# EAGLE design breakout_tester_1_0 (EAGLE 6.6.0)
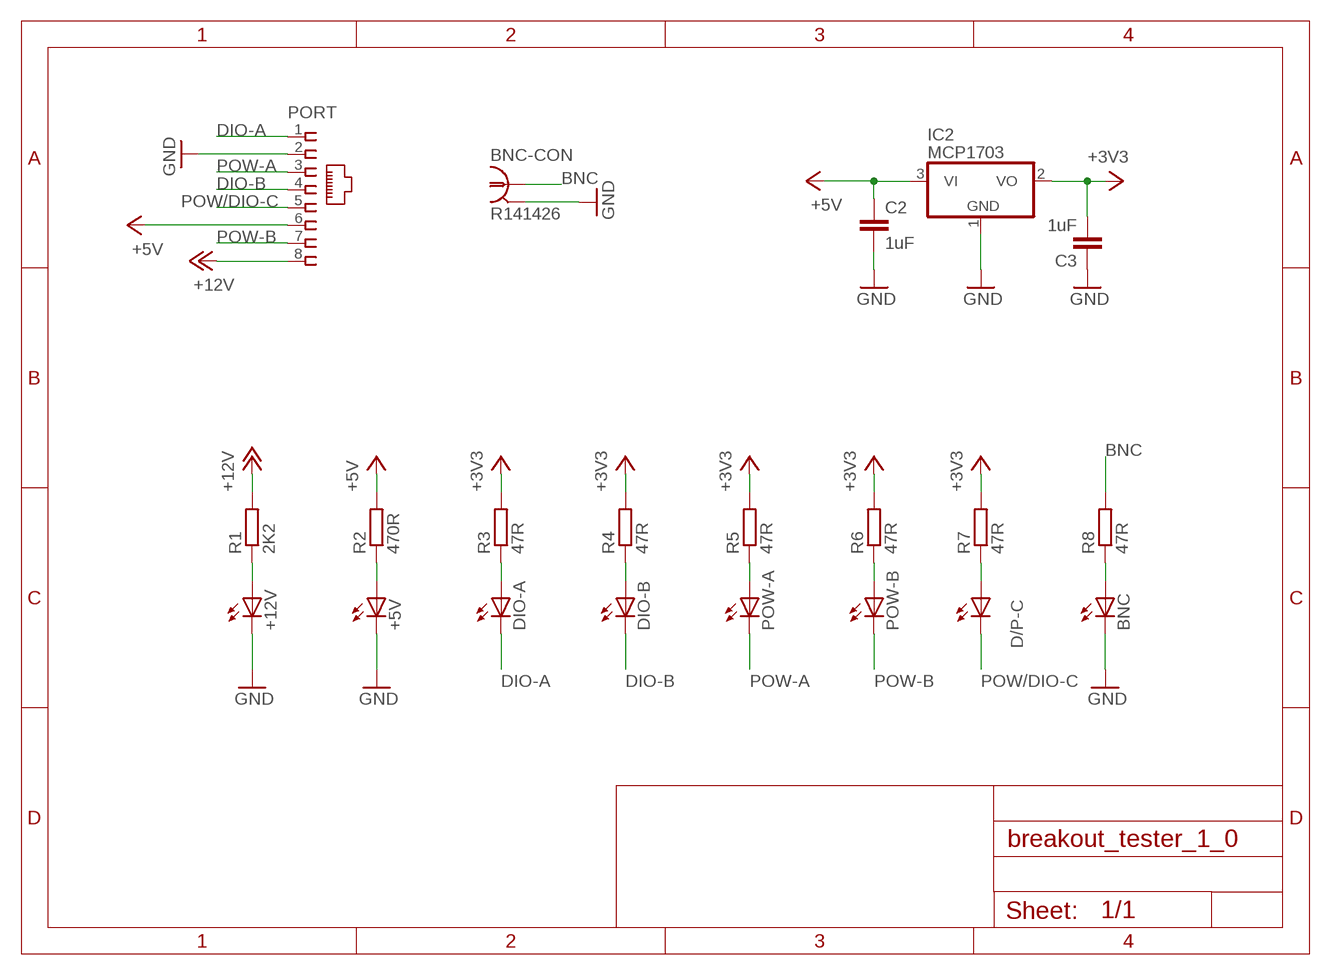
[diagram p0: schematic, sheet 1]

## Parts
+5V  LEDSML0805  [SML0805]
+12V  LEDSML0805  [SML0805]
BNC  LEDSML0805  [SML0805]
BNC-CON  R141426  [R141426]
C2  1uF  C-EUC0805  [C0805]
C3  1uF  C-EUC0805  [C0805]
D/P-C  LEDSML0805  [SML0805]
DIO-A  LEDSML0805  [SML0805]
DIO-B  LEDSML0805  [SML0805]
IC2  MCP1703  MCP1703CB  [SOT23]
PORT  RJ45VERTICAL  [RJ45-NO-SHIELD-VERTICAL]
POW-A  LEDSML0805  [SML0805]
POW-B  LEDSML0805  [SML0805]
R1  2K2  R-EU_M0805  [M0805]
R2  470R  R-EU_M0805  [M0805]
R3  47R  R-EU_M0805  [M0805]
R4  47R  R-EU_M0805  [M0805]
R5  47R  R-EU_M0805  [M0805]
R6  47R  R-EU_M0805  [M0805]
R7  47R  R-EU_M0805  [M0805]
R8  47R  R-EU_M0805  [M0805]

## Nets
+3V3: C3.2 IC2.2(VO) R3.2 R4.2 R5.2 R6.2 R7.2
+5V: C2.1 IC2.3(VI) PORT.6 R2.2
+12V: PORT.8 R1.2
BNC: BNC-CON.1 R8.2
DIO-A: DIO-A.C PORT.1
DIO-B: DIO-B.C PORT.4
GND: +5V.C +12V.C BNC-CON.2(GND) BNC.C C2.2 C3.1 IC2.1(GND) PORT.2
N$1: DIO-B.A R4.1
N$2: POW-A.A R5.1
N$3: POW-B.A R6.1
N$4: D/P-C.A R7.1
N$5: BNC.A R8.1
N$6: +12V.A R1.1
N$7: +5V.A R2.1
N$10: DIO-A.A R3.1
POW-A: PORT.3 POW-A.C
POW-B: PORT.7 POW-B.C
POW/DIO-C: D/P-C.C PORT.5

## Power pins joined to a net without a drawn wire
GND: BNC-CON.3(GND) BNC-CON.4(GND) BNC-CON.5(GND)

## Library data of the parts
+5V +12V BNC D/P-C DIO-A DIO-B POW-A POW-B = led:LED: LED OSRAM: - CHIPLED LG R971, LG N971, LY N971, LG Q971, LY Q971, LO R971, LY R971 LH N974, LH R974 LS Q976, LO Q976, LY Q976 LO Q996 - Hyper CHIPLED LW Q18S LB Q993, LB Q99A, LB R99A - SideLED LS A670, LO A670, LY A670, LG A670, LP A670 LB A673, LV A673, LT A673, LW A673 LH A674 LY A675 LS A676, LA A676, LO A676, LY A676, LW A676 LS A679, LY A679, LG A679 - Hyper Micro SIDELED® LS Y876, LA Y876, LO Y876, LY Y876 LT Y87S - SmartLED LW L88C, LW L88S LB L89C, LB L89S, LG L890 LS L89K, LO L89K, LY L89K LS L896, LA L896, LO L896, LY L896 - TOPLED LS T670, LO T670, LY T670, LG T670, LP T670 LSG T670, LSP T670, LSY T670, LOP T670, LYG T670 LG T671, LOG T671, LSG T671 LB T673, LV T673, LT T673, LW T673 LH T674 LS T676, LA T676, LO T676, LY T676, LB T676, LH T676, LSB T676, LW T676 LB T67C, LV T67C, LT T67C, LS T67K, LO T67K, LY T67K, LW E67C LS E67B, LA E67B, LO E67B, LY E67B, LB E67C, LV E67C, LT E67C LW T67C LS T679, LY T679, LG T679 LS T770, LO T770, LY T770, LG T770, LP T770 LB T773, LV T773, LT T773, LW T773 LH T774 LS E675, LA E675, LY E675, LS T675 LS T776, LA T776, LO T776, LY T776, LB T776 LHGB T686 LT T68C, LB T68C - Hyper Mini TOPLED® LB M676 - Mini TOPLED Santana® LG M470 LS M47K, LO M47K, LY M47K Source: http://www.osram.convergy.de LUXEON: - LUMILED® LXK2-PW12-R00, LXK2-PW12-S00, LXK2-PW14-U00, LXK2-PW14-V00 LXK2-PM12-R00, LXK2-PM12-S00, LXK2-PM14-U00 LXK2-PE12-Q00, LXK2-PE12-R00, LXK2-PE12-S00, LXK2-PE14-T00, LXK2-PE14-U00 LXK2-PB12-K00, LXK2-PB12-L00, LXK2-PB12-M00, LXK2-PB14-N00, LXK2-PB14-P00, LXK2-PB14-Q00 LXK2-PR12-L00, LXK2-PR12-M00, LXK2-PR14-Q00, LXK2-PR14-R00 LXK2-PD12-Q00, LXK2-PD12-R00, LXK2-PD12-S00 LXK2-PH12-R00, LXK2-PH12-S00 LXK2-PL12-P00, LXK2-PL12-Q00, LXK2-PL12-R00 Source: www.luxeon.com KINGBRIGHT: KA-3528ASYC Source: www.kingbright.com
BNC-CON = con-coax:R141426: BNC COAX CONNECTOR Radiall 50/75 Ohm Spoerle; MF: FARNELL; MPN: R141426161; OC_FARNELL: 4195115; OC_NEWARK: 14J7919
C2 = resistor:C-EU: CAPACITOR, European symbol
C3 = rcl:C-EU: CAPACITOR, European symbol
IC2 = linear:MCP1703: 250 mA, 16V, Low Quiescent Current LDO Regulator Source: http://ww1.microchip.com/downloads/en/DeviceDoc/22049b.pdf
PORT = con-tycoelectronics-vertical_RJ45:RJ45: CORCOM Modular RJ Jacks No Shield Source: www.tycoelectronics.com .. ENG_DS_1654001_1099_RJ_L_0507.pdf
R1-R8 = resistor:R-EU_: RESISTOR, European symbol

## Board
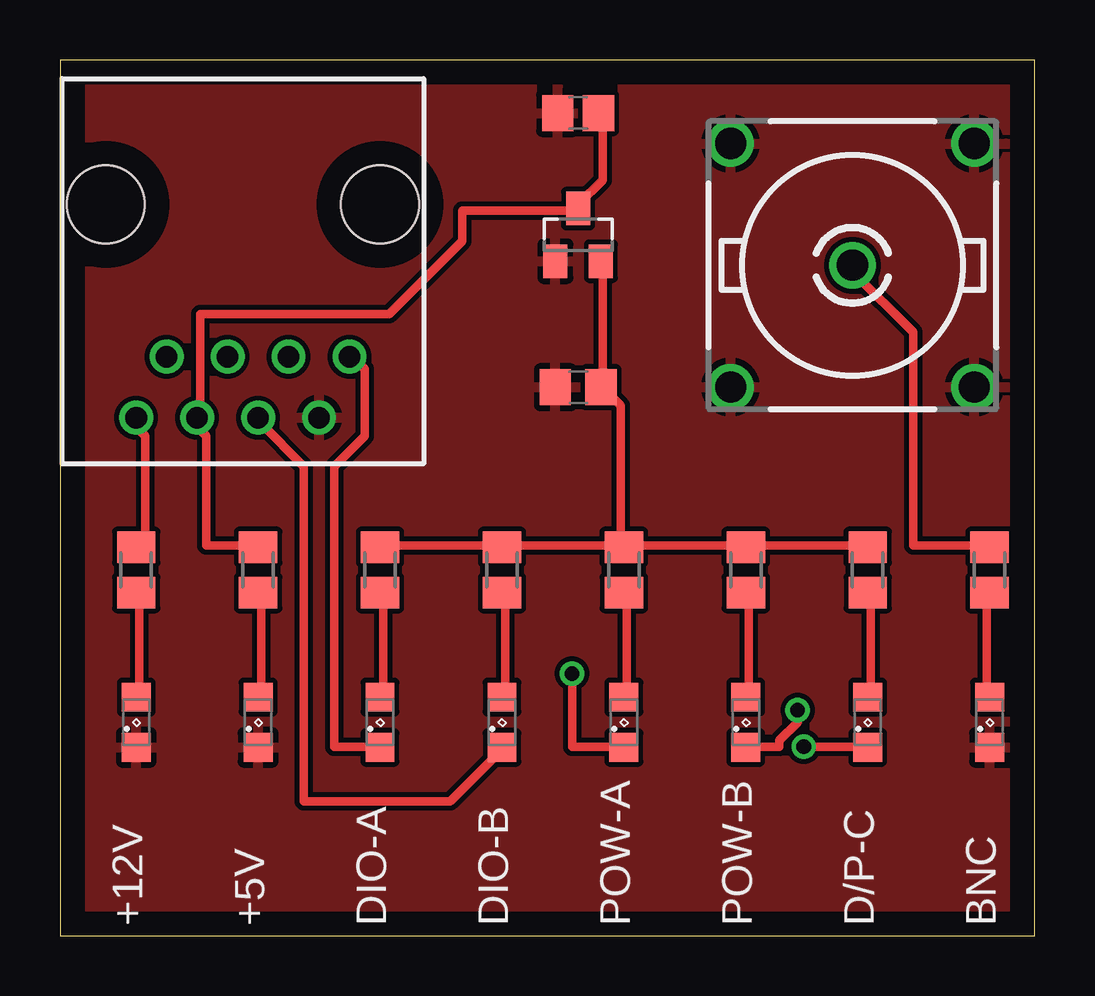
[diagram p1: board, top side]
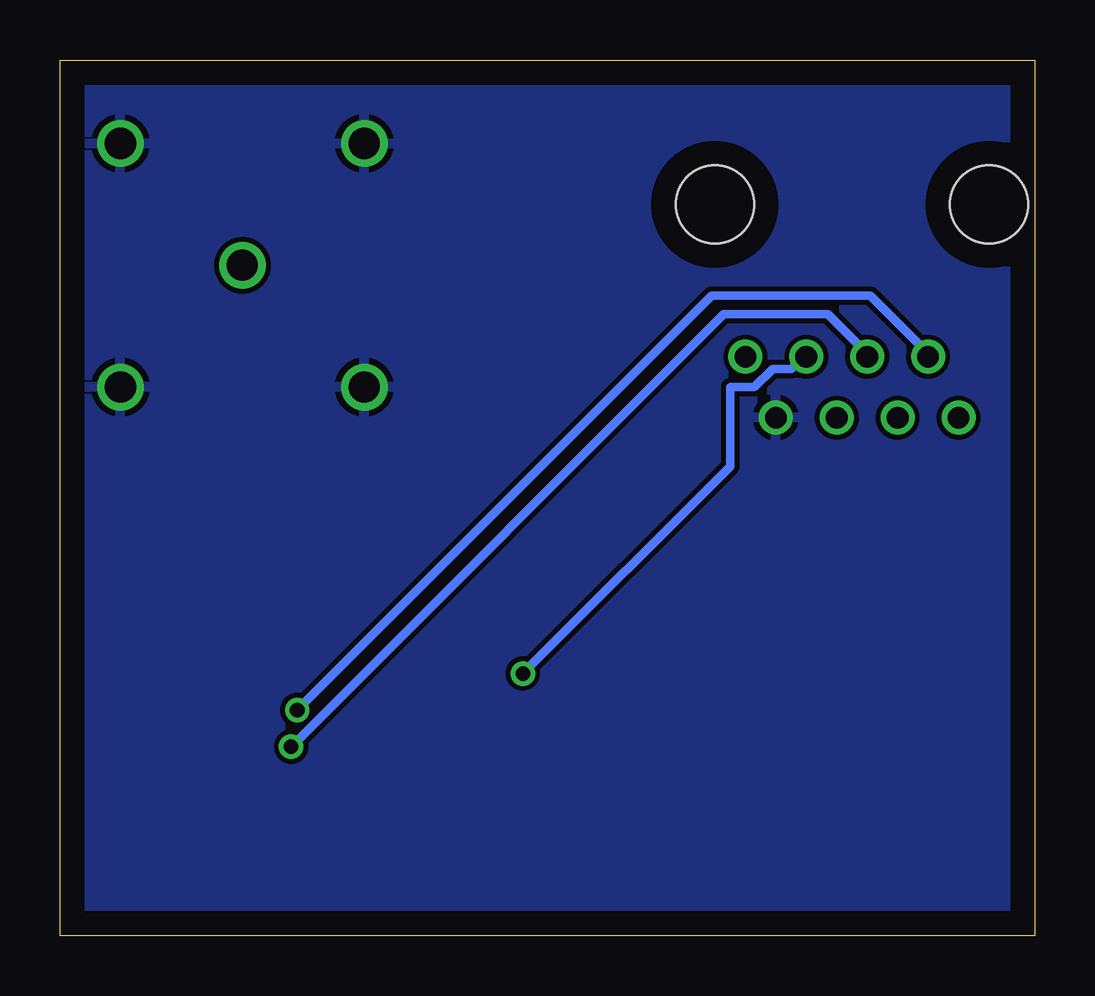
[diagram p2: board, bottom side, seen from below]

Size 40.62 x 36.5 mm. Coordinates in mm from the lower left corner, seen from the top.
Outline: 0,0 40.62,0 40.62,36.5 0,36.5 0,0
Copper layers (1*16): Top 0.035mm / dielectric 1.5mm / Bottom 0.035mm
Design rules "default *": minimum track width 14mil, minimum drill 24mil, track to track 8mil, track to pad 8mil, pad to pad 8mil, via to via 8mil, smd to smd 8mil, copper to edge 40mil, drill to drill 8mil, minimum pad ring 10mil, minimum via ring 8mil, stop-mask expansion 4mil, vias tented up to drill 0mil, thermal gap 10mil

### Footprints (pad centres in the part's own frame; a part is rotated, then mirrored left to right if it is on the bottom)
SML0805 = smd 1.2 x 1.2: A 1.05,0; C -1.05,0
R141426 = drill 1.295: 1 0,0; 2 5.08,5.08; 3 -5.08,5.08; 4 -5.08,-5.08; 5 5.08,-5.08
C0805 = smd 1.3 x 1.5: 1 -0.85,0; 2 0.85,0
C0805' = smd 1.3 x 1.5: 1 -0.95,0; 2 0.95,0
SOT23 = smd 1 x 1.4: 1 -0.95,-1.1; 2 0.95,-1.1; 3 0,1.1
RJ45-NO-SHIELD-VERTICAL = drill 0.9 pad 1.4: 1 -4.445,5.08; 2 -3.175,7.62; 3 -1.905,5.08; 4 -0.635,7.62; 5 0.635,5.08; 6 1.905,7.62; 7 3.175,5.08; 8 4.445,7.62 | hole 3.251: -5.715,-1.27; 5.715,-1.27
M0805 = smd 1.3 x 1.6: 1 -0.95,0; 2 0.95,0

### Placement (x,y rotation side)
+5V  8.26,8.89 90 top
+12V  3.17,8.89 90 top
BNC  38.73,8.89 90 top
BNC-CON  33.02,27.94 0 top
C2  21.59,34.29 180 top
C3  1uF  [C0805']  21.59,22.86 0 top
D/P-C  33.66,8.89 90 top
DIO-A  13.34,8.89 90 top
DIO-B  18.41,8.89 90 top
IC2  21.59,29.21 0 top
PORT  7.62,29.21 180 top
POW-A  23.5,8.89 90 top
POW-B  28.57,8.89 90 top
R1  3.17,15.24 90 top
R2  8.26,15.24 90 top
R3  13.34,15.24 90 top
R4  18.41,15.24 90 top
R5  23.5,15.24 90 top
R6  28.57,15.24 90 top
R7  33.66,15.24 90 top
R8  38.73,15.24 90 top

### Tracks (layer width: path | path; a pad name or v marks a point on that pad's centre or on a via)
+3V3
  Top 0.356: R3.2 13.46,16.26 18.29,16.26 R4.2 18.54,16.26 23.37,16.26 | 22.61,22.86 22.61,27.94 IC2.2 | R7.2 33.53,16.26 28.7,16.26 R6.2 28.45,16.26 23.62,16.26 R5.2 23.37,16.26 | 22.61,22.86 23.37,22.1 23.37,16.26 | 22.61,22.86 C3.2
+5V
  Top 0.356: C2.1 22.61,34.29 22.61,31.5 21.59,30.48 IC2.3 21.59,30.23 16.76,30.23 16.76,28.96 13.72,25.91 5.84,25.91 5.84,21.59 | 5.84,21.59 5.84,21.08 6.1,20.83 6.1,16.26 8.13,16.26 R2.2 | 5.84,21.59 PORT.6
+12V
  Top 0.356: R1.2 3.3,16.26 3.56,16.51 3.56,20.83 3.3,21.08 3.3,21.59 PORT.8
BNC
  Top 0.356: BNC-CON.1 33.02,27.69 35.56,25.15 35.56,16.26 38.61,16.26 R8.2
DIO-A
  Top 0.356: DIO-A.C 13.21,7.87 11.43,7.87 11.43,19.56 12.7,20.83 12.7,23.62 12.19,24.13 PORT.1
DIO-B
  Top 0.356: DIO-B.C 18.29,7.62 16.26,5.59 10.16,5.59 10.16,19.56 8.38,21.34 8.38,21.59 PORT.4
GND
  pour Bottom: 0,36.83 0,0 40.64,0 40.64,36.83
  pour Top: 0,0 0,36.83 40.64,36.83 40.64,0
N$1
  Top 0.356: DIO-B.A 18.54,10.16 18.54,14.22 R4.1
N$2
  Top 0.356: POW-A.A 23.62,10.16 23.62,14.22 R5.1
N$3
  Top 0.356: POW-B.A 28.7,10.16 28.7,14.22 R6.1
N$4
  Top 0.356: D/P-C.A 33.78,10.16 33.78,14.22 R7.1
N$5
  Top 0.356: BNC.A 38.61,10.16 38.61,14.22 R8.1
N$6
  Top 0.356: +12V.A 3.3,10.16 3.3,14.22 R1.1
N$7
  Top 0.356: +5V.A 8.38,10.16 8.38,14.22 R2.1
N$10
  Top 0.356: DIO-A.A 13.46,10.16 13.46,14.22 R3.1
POW-A  (via drill 0.61)
  Top 0.356: v21.34,10.92 21.34,7.87 23.37,7.87 POW-A.C
  Bottom 0.356: v21.34,10.92 12.7,19.56 12.7,22.86 11.68,22.86 10.92,23.62 10.16,23.62 9.65,24.13 PORT.3
POW-B  (via drill 0.61)
  Top 0.356: v30.73,9.4 30.73,8.89 29.97,8.13 29.97,7.87 28.7,7.87 POW-B.C
  Bottom 0.356: v30.73,9.4 13.46,26.67 6.86,26.67 4.32,24.13 PORT.7
POW/DIO-C  (via drill 0.61)
  Top 0.356: v30.99,7.87 33.53,7.87 D/P-C.C
  Bottom 0.356: v30.99,7.87 12.95,25.91 8.64,25.91 6.86,24.13 PORT.5